# Altium project SWR_PW.PrjPCB
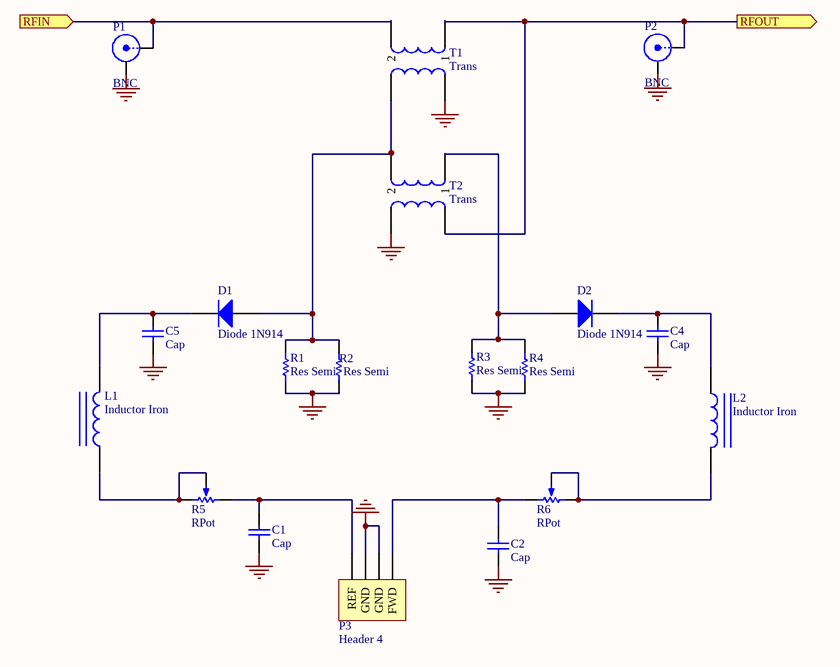
[diagram p0: SWR.SchDoc]
1 sheet, 19 parts. Net scope: flat (ports and power ports of the same name join across sheets).
Board file: SWRmeter.PcbDoc

## Sheet SWR.SchDoc
size A4

### Parts
C1  Cap  [RAD-0.3]
C2  Cap  [RAD-0.3]
C4  Cap  [RAD-0.3]
C5  Cap  [RAD-0.3]
D1  Diode 1N914  [DIO7.1-3.9x1.9]
D2  Diode 1N914  [DIO7.1-3.9x1.9]
L1  Inductor Iron  [AXIAL-0.3]
L2  Inductor Iron  [AXIAL-0.3]
P1  BNC  [BNC_RA CON]
P2  BNC  [BNC_RA CON]
P3  Header 4  [HDR1X4]
R1  Res Semi  [AXIAL-0.5]
R2  Res Semi  [AXIAL-0.5]
R3  Res Semi  [AXIAL-0.5]
R4  Res Semi  [AXIAL-0.5]
R5  RPot  [VR5]
R6  RPot  [VR5]
T1  Trans  [TRANS]
T2  Trans  [TRANS]

### Ports
RFIN (in), RFOUT (out)

### Nets
GND: C1.1 C2.1 C4.1 C5.1 P1.2(Y) P2.2(Y) P3.2(GND) P3.3(GND) R1.1 R2.1 R3.1 R4.1 T1.3 T2.4
NetC1_2: C1.2 P3.4(REF) R5.1(TOP)
NetC2_2: C2.2 P3.1(FWD) R6.2(BOT)
NetC4_2: C4.2 D2.2(K) L2.1
NetC5_2: C5.2 D1.2(K) L1.2
NetD1_1: D1.1(A) R1.2 R2.2 T1.4 T2.2
NetD2_1: D2.1(A) R3.2 R4.2 T2.1
NetL1_1: L1.1 R5.2(BOT) R5.3(TAP)
NetL2_2: L2.2 R6.1(TOP) R6.3(TAP)
NetP1_1: P1.1(X) T1.2 ; port RFIN
NetP2_1: P2.1(X) T1.1 T2.3 ; port RFOUT

### Library data of the parts
C1 C2 C4 C5 = Cap: Capacitor; Published: 8-Jun-2000; LatestRevisionDate: 17-Jul-2002; LatestRevisionNote: Re-released for DXP Platform.; Publisher: Altium Limited
D1 D2 = Diode 1N914: High Conductance Fast Diode; Published: 8-Jun-2000; LatestRevisionDate: 17-Jul-2002; LatestRevisionNote: Re-released for DXP Platform.; DatasheetDocument: 1997; PackageReference: DO-35; Publisher: Altium Limited; ComponentLink1Description: Manufacturer Link; ComponentLink1URL: http://www.fairchildsemi.com/; Code_JEDEC: DO-204-AH
L1 L2 = Inductor Iron: Magnetic-Core Inductor; Published: 24-Mar-1999; LatestRevisionDate: 17-Jul-2002; LatestRevisionNote: Re-released for DXP Platform.; Publisher: Altium Limited
P1 P2 = BNC: BNC Elbow Connector; LatestRevisionDate: 17-Jul-2002; LatestRevisionNote: Re-released for DXP Platform.; Publisher: Altium Limited
P3 = Header 4: Header, 4-Pin; LatestRevisionDate: 17-Jul-2002; LatestRevisionNote: Re-released for DXP Platform.; Publisher: Altium Limited
R1-R4 = Res Semi: Semiconductor Resistor; Published: 8-Jun-2000; LatestRevisionDate: 17-Jul-2002; LatestRevisionNote: Re-released for DXP Platform.; Publisher: Altium Limited
R5 R6 = RPot: Potentiometer; Sim Note: Enter the Resistance value and the set point into parameter fields.; Published: 8-Jun-2000; LatestRevisionDate: 17-Jul-2002; LatestRevisionNote: Re-released for DXP Platform.; Publisher: Altium Limited
T1 T2 = Trans: Transformer; Published: 24-Mar-1999; LatestRevisionDate: 17-Jul-2002; LatestRevisionNote: Re-released for DXP Platform.; Publisher: Altium Limited